# EAGLE design resistor_test_2 (EAGLE 7.6.0)
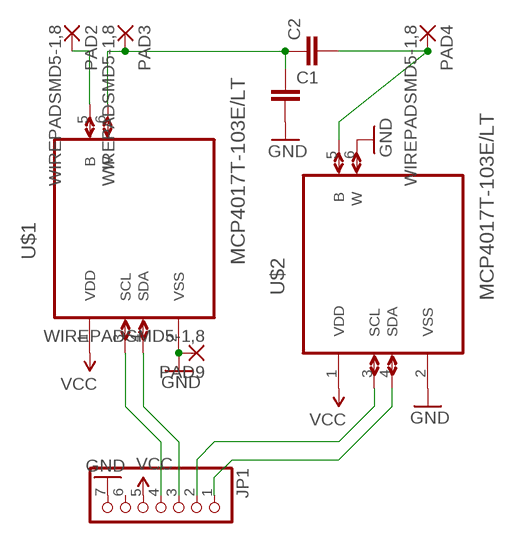
[diagram p0: schematic, sheet 1]

## Parts
C1  C-EUC0603  [C0603]
C2  C-EUC0603  [C0603]
JP1  PINHD-1X7  [1X07]
PAD2  WIREPADSMD5-1,8  [5-1,8]
PAD3  WIREPADSMD5-1,8  [5-1,8]
PAD4  WIREPADSMD5-1,8  [5-1,8]
PAD9  WIREPADSMD5-1,8  [5-1,8]
U$1  MCP4017T-103E/LT  [SOT65P210X110-6N]
U$2  MCP4017T-103E/LT  [SOT65P210X110-6N]

## Nets
GND: C1.2 JP1.7 PAD9.1(P) U$1.2(VSS) U$2.2(VSS) U$2.6(W)
N$1: JP1.4 U$1.3(SCL)
N$2: JP1.3 U$1.4(SDA)
N$3: JP1.2 U$2.3(SCL)
N$4: JP1.1 U$2.4(SDA)
N$5: C1.1 C2.1 PAD3.1(P) U$1.6(W)
N$6: C2.2 PAD4.1(P) U$2.5(B)
N$8: PAD2.1(P) U$1.5(B)
VCC: JP1.5 U$1.1(VDD) U$2.1(VDD)
Unconnected: JP1.6

## Library data of the parts
C1 C2 = rcl:C-EU: CAPACITOR, European symbol
JP1 = pinhead:PINHD-1X7: PIN HEADER
PAD2-PAD4 PAD9 = wirepad:WIREPAD: Wire PAD connect wire on PCB
U$1 U$2 = MCP4017T-103E_LT:MCP4017T-103E/LT: Digital POT; AVAILABILITY: Good; DESCRIPTION: MCP4017 Series Single 7-Bit 128 Step I2C 10 kOhm Volatile Digital POT - SC-70-6; MF: Microchip; MP: MCP4017T-103E/LT; PACKAGE: SC-70 Microchip; PRICE: 0.46 USD

## Net classes
0 default: width 0.406 mm

## Board
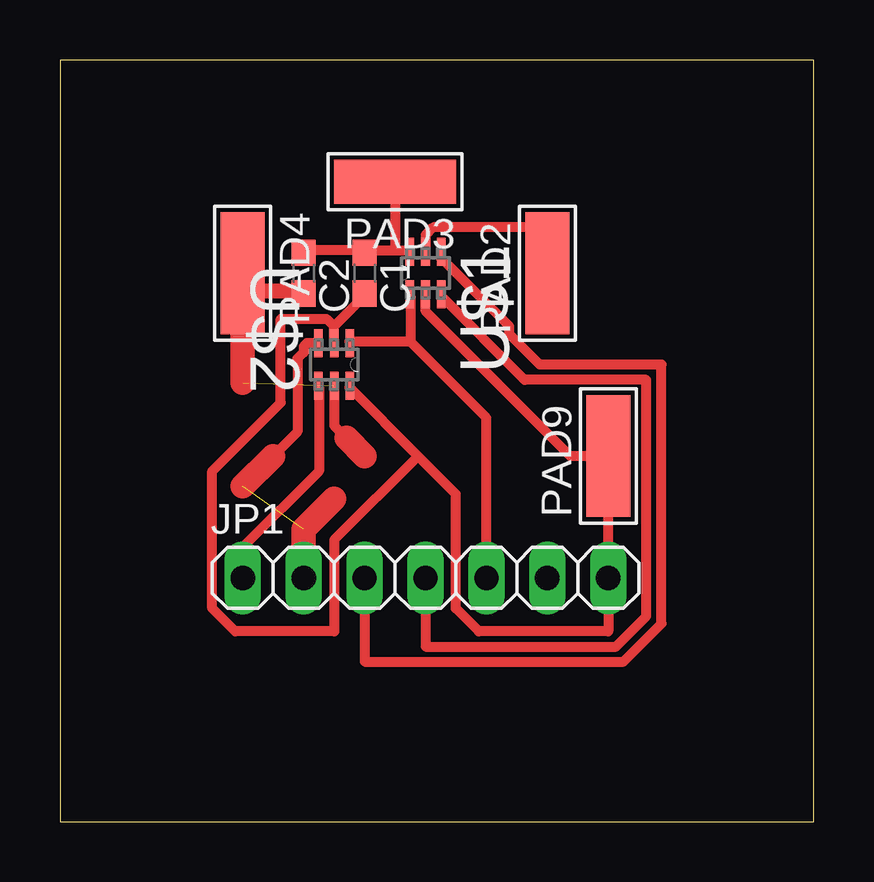
[diagram p1: board, top side]

Size 31.42 x 31.74 mm. Coordinates in mm from the lower left corner, seen from the top.
Outline: 0,0 31.42,0 31.42,31.74 0,31.74 0,0
Copper layers (1*16): Top 0.035mm / dielectric 1.5mm / Bottom 0.035mm
Design rules "default": minimum track width 10mil, minimum drill 24mil, track to track 8mil, track to pad 8mil, pad to pad 8mil, via to via 8mil, smd to smd 8mil, copper to edge 40mil, drill to drill 8mil, minimum pad ring 10mil, minimum via ring 8mil, stop-mask expansion 4mil, vias tented up to drill 0mil, thermal gap 10mil

### Footprints (pad centres in the part's own frame; a part is rotated, then mirrored left to right if it is on the bottom)
C0603 = smd 1.1 x 1: 1 -0.85,0; 2 0.85,0
1X07 = drill 1.016 long: 1 -7.62,0; 2 -5.08,0; 3 -2.54,0; 4 0,0; 5 2.54,0; 6 5.08,0; 7 7.62,0
5-1,8 = smd 1.829 x 5.08: 1 0,0
SOT65P210X110-6N = smd 1.168 x 0.356: 1 -0.889,0.66; 2 -0.889,0; 3 -0.889,-0.66; 4 0.889,-0.66; 5 0.889,0; 6 0.889,0.66

### Placement (x,y rotation side)
C1  12.7,22.86 270 top
C2  10.16,22.86 270 top
JP1  15.24,10.16 0 top
PAD2  20.32,22.86 0 top
PAD3  13.97,26.67 90 top
PAD4  7.62,22.86 180 top
PAD9  22.86,15.24 0 top
U$1  15.24,22.86 90 top
U$2  11.43,19.05 270 top

### Tracks (layer width: path | path; a pad name or v marks a point on that pad's centre or on a via)
GND
  Top 0.406: U$1.2 15.24,21.27 21.27,15.24 PAD9.1 JP1.7 22.86,7.94 17.46,7.94 16.51,8.89 16.51,13.65 14.92,15.24 | 11.43,20.64 12.7,21.91 C1.2 | U$2.2 11.43,20.64 | 14.92,15.24 12.07,18.1 U$2.6 | 11.43,20.64 11.11,20.95 9.21,20.95 9.21,17.46 6.35,14.6 6.35,8.89 7.3,7.94 11.43,7.94 11.43,11.75 14.92,15.24
N$1
  Top 0.406: JP1.4 15.24,7.3 23.18,7.3 24.45,8.57 24.45,18.41 19.37,18.41 15.88,21.91 U$1.3
N$2
  Top 0.406: JP1.3 12.7,6.67 23.49,6.67 25.08,8.26 25.08,19.05 20,19.05 18.73,20.32 18.73,20.64 15.88,23.5 U$1.4
N$3  (1 unrouted)
  Top 0.406: U$2.3 10.29,19.94 10.16,19.81 10.16,19.56 9.91,19.3 9.91,16.26 8.89,15.24
  Top 1.016: 8.89,15.24 7.62,13.97 | JP1.2 10.16,12.19 11.43,13.46
N$4
  Top 0.406: U$2.4 10.79,18.1 10.79,14.6 7.62,11.43 JP1.1
N$5
  Top 0.406: 12.7,23.81 10.16,23.81 C2.1 | 12.7,23.81 13.97,23.81 | 13.97,23.81 14.61,23.81 U$1.6 | 12.7,23.81 C1.1 | PAD3.1 13.97,23.81
N$6  (1 unrouted)
  Top 0.406: PAD4.1 7.62,22.23 10.16,22.23 C2.2 8.04,22.01 7.62,21.59 | U$2.5 11.43,16.51 11.94,16
  Top 1.016: 11.94,16 12.7,15.24 | 7.62,21.59 7.62,18.29
N$8
  Top 0.406: U$1.5 15.24,24.45 15.56,24.77 20.32,24.77 PAD2.1
VCC
  Top 0.406: 14.61,20 12.07,20 U$2.1 | 14.61,20 14.61,21.91 U$1.1 | 14.61,20 17.78,16.83 JP1.5